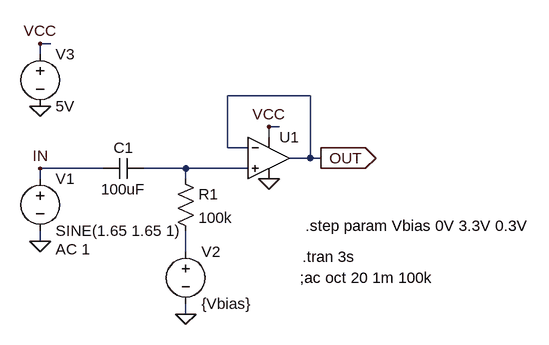
[diagram p0: schematic ArduinoLFO_NonInv_Bias_Test.asc]
ArduinoLFO_NonInv_Bias_Test.asc, the LTspice schematic file:
Version 4
SHEET 1 880 680
WIRE 48 0 32 0
WIRE 32 16 32 0
WIRE 448 80 320 80
WIRE 400 128 384 128
WIRE 384 144 384 128
WIRE 320 160 320 80
WIRE 352 160 320 160
WIRE 448 176 448 80
WIRE 448 176 416 176
WIRE 464 176 448 176
WIRE 128 192 32 192
WIRE 256 192 192 192
WIRE 352 192 256 192
WIRE 32 208 32 192
WIRE 256 208 256 192
WIRE 32 304 32 288
WIRE 256 320 256 288
WIRE 256 416 256 400
FLAG 256 416 0
FLAG 32 304 0
FLAG 384 128 VCC
FLAG 464 176 OUT
IOPIN 464 176 Out
FLAG 384 208 0
FLAG 32 96 0
FLAG 32 0 VCC
FLAG 32 192 IN
SYMBOL Opamps\\UniversalOpamp2 384 176 R0
SYMATTR InstName U1
SYMBOL voltage 32 192 R0
WINDOW 123 24 124 Left 2
WINDOW 39 0 0 Left 2
SYMATTR InstName V1
SYMATTR Value SINE(1.65 1.65 1)
SYMATTR Value2 AC 1
SYMBOL cap 192 176 R90
WINDOW 0 0 32 VBottom 2
WINDOW 3 32 32 VTop 2
SYMATTR InstName C1
SYMATTR Value 100uF
SYMBOL res 240 192 R0
SYMATTR InstName R1
SYMATTR Value 100k
SYMBOL voltage 256 304 R0
SYMATTR InstName V2
SYMATTR Value {Vbias}
SYMBOL voltage 32 0 R0
SYMATTR InstName V3
SYMATTR Value 5V
TEXT 440 280 Left 2 !.step param Vbias 0V 3.3V 0.3V
TEXT 436 328 Left 2 !.tran 3s
TEXT 432 360 Left 2 !;ac oct 20 1m 100k

The netlist it stands for:
* ArduinoLFO_NonInv_Bias_Test.asc
XU1 N001 OUT VCC 0 OUT level.2 Avol=1Meg GBW=10Meg Slew=10Meg ilimit=25m rail=0 Vos=0 phimargin=45 en=0 enk=0 in=0 ink=0 Rin=500Meg  ; pins IN+ IN- V+ V- OUT
V1 IN 0 SINE(1.65 1.65 1) AC 1
C1 N001 IN 100uF
R1 N001 N002 100k
V2 N002 0 {Vbias}
V3 VCC 0 5V
.step param Vbias 0V 3.3V 0.3V
.tran 3s
;ac oct 20 1m 100k
.lib UniversalOpamps2.sub
.backanno
.end